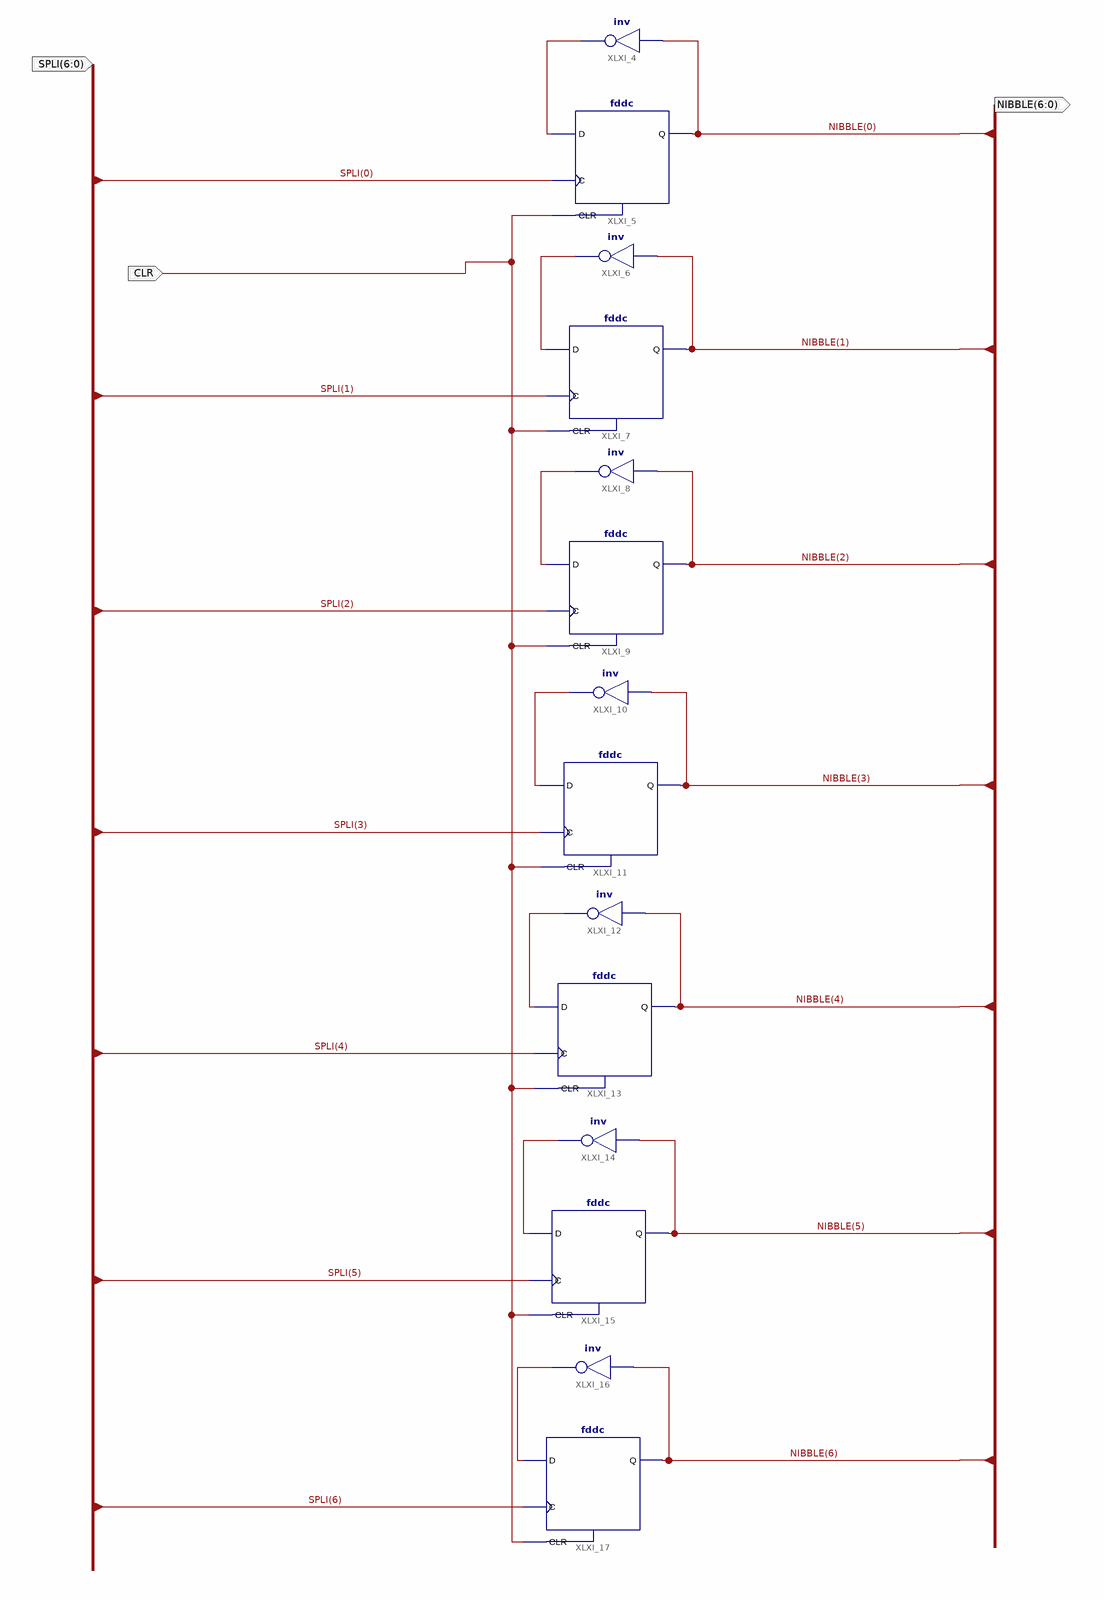
[diagram p0: schematic sheet 1]
// Xilinx ISE schematic Dual_Flank_Toggler.sch (xbr) as structural Verilog: 14 symbols, 3 ports
module Dual_Flank_Toggler (
  input  [6:0] SPLI,
  input  CLR,
  output [6:0] NIBBLE
);

  wire XLXN_1, XLXN_10, XLXN_12, XLXN_14, XLXN_16, XLXN_18, XLXN_20;

  not XLXI_4 (XLXN_1, NIBBLE[0]);
  fddc XLXI_5 (.C(SPLI[0]), .CLR(CLR), .D(XLXN_1), .Q(NIBBLE[0]));
  not XLXI_6 (XLXN_10, NIBBLE[1]);
  fddc XLXI_7 (.C(SPLI[1]), .CLR(CLR), .D(XLXN_10), .Q(NIBBLE[1]));
  not XLXI_8 (XLXN_12, NIBBLE[2]);
  fddc XLXI_9 (.C(SPLI[2]), .CLR(CLR), .D(XLXN_12), .Q(NIBBLE[2]));
  not XLXI_10 (XLXN_14, NIBBLE[3]);
  fddc XLXI_11 (.C(SPLI[3]), .CLR(CLR), .D(XLXN_14), .Q(NIBBLE[3]));
  not XLXI_12 (XLXN_16, NIBBLE[4]);
  fddc XLXI_13 (.C(SPLI[4]), .CLR(CLR), .D(XLXN_16), .Q(NIBBLE[4]));
  not XLXI_14 (XLXN_18, NIBBLE[5]);
  fddc XLXI_15 (.C(SPLI[5]), .CLR(CLR), .D(XLXN_18), .Q(NIBBLE[5]));
  not XLXI_16 (XLXN_20, NIBBLE[6]);
  fddc XLXI_17 (.C(SPLI[6]), .CLR(CLR), .D(XLXN_20), .Q(NIBBLE[6]));
endmodule
